# Altium project recall_ble_v0_1.PrjPcb
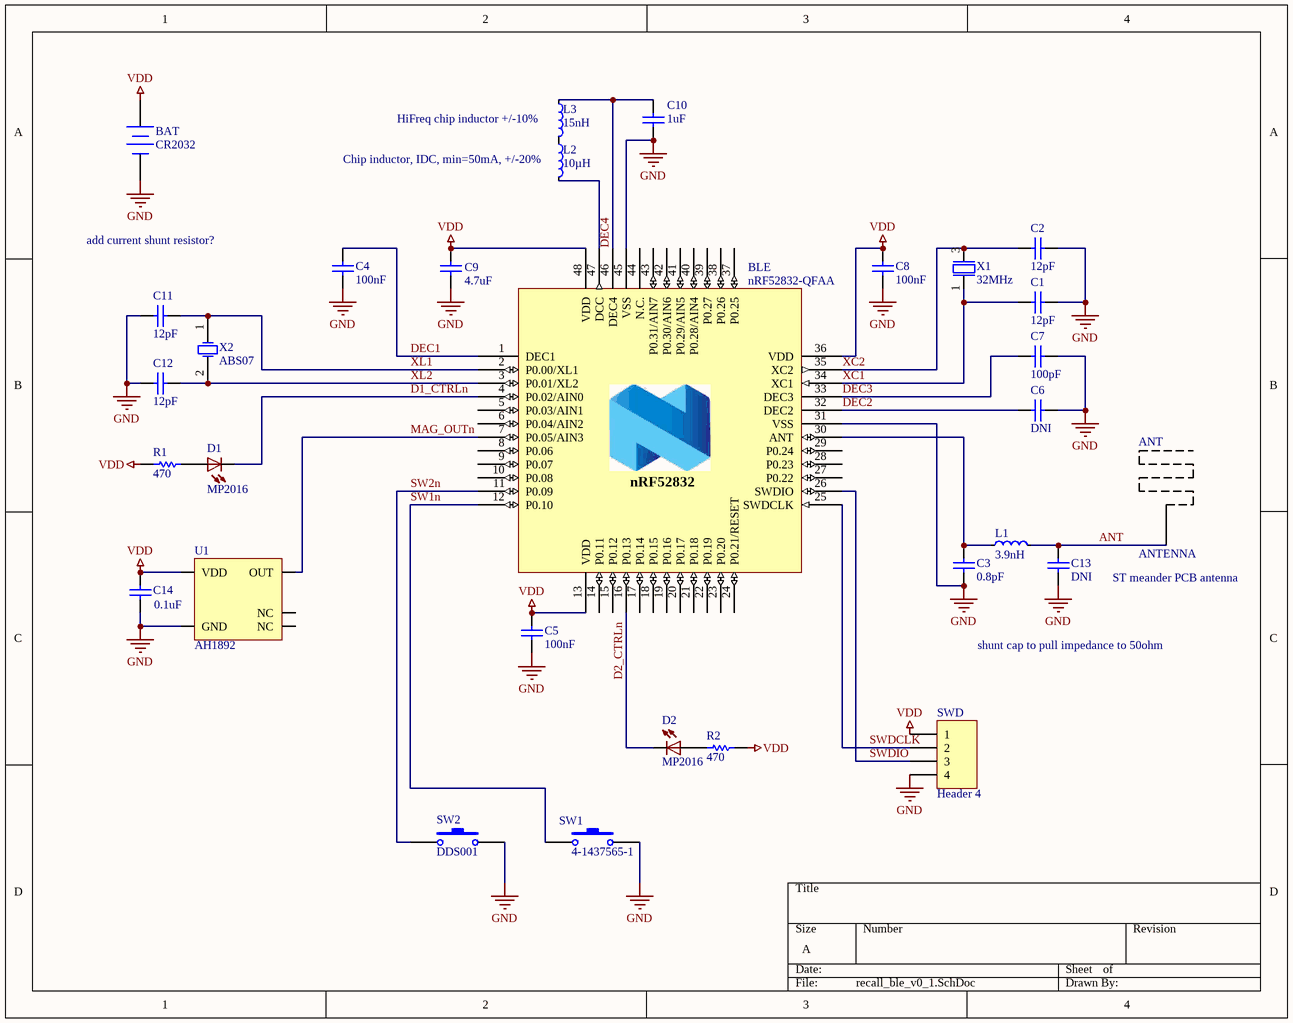
[diagram p0: recall_ble_v0_1.SchDoc]
1 sheet, 30 parts. Net scope: global (net labels, ports and power ports of the same name join across sheets).
Board files: recall_panel_v0_1.PcbDoc, recall_ble_v0_1.PcbDoc

## Sheet recall_ble_v0_1.SchDoc
size A

### Parts
ANT  ANTENNA  [ANTENNA_PCB]
BAT  CR2032  [BAT-HLD-001-THM]
BLE  nRF52832-QFAA  [QFN40P600X600X90-48N]
C1  value 12pF  [CAP_0402R]  (hidden comment: CAP)
C2  value 12pF  [CAP_0402R]  (hidden comment: CAP)
C3  value 0.8pF  [CAP_0402R]  (hidden comment: CAP)
C4  value 100nF  [CAP_0402R]  (hidden comment: CAP)
C5  value 100nF  [CAP_0402R]  (hidden comment: CAP)
C6  value DNI  [CAP_0402R]  (hidden comment: CAP)
C7  value 100pF  [CAP_0402R]  (hidden comment: CAP)
C8  value 100nF  [CAP_0402R]  (hidden comment: CAP)
C9  value 4.7uF  [CAP_0603R]  (hidden comment: CAP)
C10  value 1uF  [CAP_0603R]  (hidden comment: CAP)
C11  value 12pF  [CAP_0402R]  (hidden comment: CAP)
C12  value 12pF  [CAP_0402R]  (hidden comment: CAP)
C13  value DNI  [CAP_0402R]  (hidden comment: CAP)
C14  value 0.1uF  [CAP_0402R]  (hidden comment: CAP)
D1  MP2016  [MP2016_centered]
D2  MP2016  [MP2016_centered]
L1  3.9nH  [INDC1005X04L]
L2  10µH  [INDC1608X06L]
L3  15nH  [INDC1005X04L]
R1  value 470  [RES_0402]  (hidden comment: RES)
R2  value 470  [RES_0402]  (hidden comment: RES)
SW1  4-1437565-1  [4-1437565-1]
SW2  DDS001  [DDS001]
SWD  Header 4  [HDR1X4_SWD]
U1  AH1892  [sot-553]
X1  32MHz  [XRCGB]
X2  ABS07  [ABS07]

### Nets
GND: BAT.2(-) BLE.31(VSS) BLE.45(VSS) BLE.49(GND) C1.2 C2.2 C3.1 C4.1 C5.1 C6.2 C7.2 C8.1 C9.1 C10.1 C11.1 C12.1 C13.1 C14.1 SW1.2 SW2.2 SWD.4 U1.4(GND) X1.2(GND) X1.4(GND)
VDD: BAT.1(+) BLE.13(VDD) BLE.36(VDD) BLE.48(VDD) C5.2 C8.2 C9.2 C14.2 R1.1 R2.1 SWD.1 U1.1(VDD)
ANT: ANT.1 C13.2 L1.2
D1_CTRLn: BLE.4(P0.02/AIN0) D1.C
D2_CTRLn: BLE.16(P0.13) D2.C
DEC1: BLE.1(DEC1) C4.2
DEC2: BLE.32(DEC2) C6.1
DEC3: BLE.33(DEC3) C7.1
DEC4: BLE.46(DEC4) C10.2 L3.1
MAG_OUTn: BLE.7(P0.05/AIN3) U1.5(OUT)
SW1n: BLE.12(P0.10) SW1.1
SW2n: BLE.11(P0.09) SW2.1
SWDCLK: BLE.25(SWDCLK) SWD.2
SWDIO: BLE.26(SWDIO) SWD.3
XC1: BLE.34(XC1) C1.1 X1.1(inp)
XC2: BLE.35(XC2) C2.1 X1.3(out)
XL1: BLE.2(P0.00/XL1) C11.2 X2.1(OSC1)
XL2: BLE.3(P0.01/XL2) C12.2 X2.2(OSC2)
NetBLE_30: BLE.30(ANT) C3.2 L1.1
NetBLE_47: BLE.47(DCC) L2.2
NetD1_A: D1.A R1.2
NetD2_A: D2.A R2.2
NetL2_1: L2.1 L3.2

Not connected (* = marked no-connect by the designer): BLE 5(P0.03/AIN1) 6(P0.04/AIN2) 8(P0.06) 9(P0.07) 10(P0.08) 14(P0.11) 15(P0.12) 17(P0.14) 18(P0.15) 19(P0.16) 20(P0.17) 21(P0.18) 22(P0.19) 23(P0.20) 24(P0.21/RESET) 27(P0.22) 28(P0.23) 29(P0.24) 37(P0.25) 38(P0.26) 39(P0.27) 40(P0.28/AIN4) 41(P0.29/AIN5) 42(P0.30/AIN6) 43(P0.31/AIN7) 44(N.C.); U1 2(NC) 3(NC)

### Notes on the sheet
- (near L2) Chip inductor, IDC, min=50mA, +/-20%
- (near L3) HiFreq chip inductor +/-10%
- add current shunt resistor?
- ST meander PCB antenna
- shunt cap to pull impedance to 50ohm
- (in symbol nRF52832_QFAA) nRF52832

### Library data of the parts
ANT = ANTENNA: PCB Antenna for BLE
BAT = Battery: Published: 24-Mar-1999; LatestRevisionDate: 17-Jul-2002; LatestRevisionNote: Re-released for DXP Platform.; PackageReference: BAT-2; Publisher: Altium Limited; PackageDescription: Battery; 2 Leads
BLE = nRF52832_QFAA: Multi-protocol Bluetooth Low Energy and 2.4GHz proprietary system-on-chip; Manufacturer: Nordic Semiconductor; Artikkelnr Noca: N.A.; Part Number: nRF52832-QFAA; Manufacturer Part Number: nRF52832-QFAA; Datasheet: *; LatestRevisionDate: 2014-11-26; Pin Count: 48; Publisher: Nordic Semiconductor; Published: 2014-11-26; Value: nRF52832-QFAA; Note: *; Supplier: Nordic Semiconductor; Supplier part number: *; 2nd source Supplier: *; 2nd source part number: *; Footprint Doc: QFN-48; Artikkelnr Simpro: N.A.
C1-C14 = CAP: Capacitor; Published: 8-Jun-2000; LatestRevisionDate: 29-May-2009; LatestRevisionNote: IPC-7351 Footprint Added.; PackageReference: C1206; Publisher: Altium Limited; PackageDescription: Chip Capacitor
D1 D2 = MP2016: MP2016 White LED
L1 L3 = IND_0402: High frequency chip inductor ±10%; Part Number: L0402-15n; Manufacturer: Taiyo Yuden; Manufacturer Part Number: HK100515NJ-T; 2nd source part number: 658-1328; Artikkelnr Noca: 33029323; Artikkelnr Simpro: N.A.; LatestRevisionDate: 2012-09-19; Pin Count: 2; Publisher: Nordic Semiconductor; Published: 2010-07-12; Note: High frequency chip inductor ±10%; Supplier: Digi-Key; Datasheet: http://www.yuden.co.jp/productdata/catalog/en/mlci04_e.pdf; Supplier part number: 587-1521-1-ND; 2nd source Supplier: Farnell; Footprint Doc: 0402
  L1: Value: 3.9nH
  L3: Value: 15nH
L2 = IND_0603: Chip inductor, IDC,min = 50 mA, ±20%; Part Number: L0603-10µ; Manufacturer: Taiyo Yuden; Manufacturer Part Number: LBMF1608T100K; 2nd source part number: 178-6105; Note: LBMF1608T100K 10µH 80mA 0603; Artikkelnr Noca: 33029314; Artikkelnr Simpro: N.A.; Datasheet: http://www.yuden.co.jp/ut/product/pdf/elb2_e.pdf; LatestRevisionDate: 2012-09-19; Pin Count: 2; Publisher: Nordic Semiconductor; Published: 2010-02-24; Value: 10µH; Supplier: Digi-Key; Supplier part number: 587-1714-1-ND; 2nd source Supplier: Farnell; Footprint Doc: 0603
R1 R2 = RES: Resistor; Published: 8-Jun-2000; LatestRevisionDate: 17-Jul-2002; LatestRevisionNote: Re-released for DXP Platform.; PackageReference: AXIAL-0.3; Publisher: Altium Limited; PackageDescription: Axial Device, Thru-Hole; 2 Leads; 0.3 in Pin Spacing
SW1 = SW-TACT: Translucent Conductive Silicone Elastomer Switch; Published: 24-Mar-1999; LatestRevisionDate: 17-Jul-2002; LatestRevisionNote: Re-released for DXP Platform.; PackageReference: SPST-2; Publisher: Altium Limited; PackageDescription: Switch; 2 Leads
SW2 = SW-PB: Translucent Conductive Silicone Elastomer Switch; Published: 24-Mar-1999; LatestRevisionDate: 17-Jul-2002; LatestRevisionNote: Re-released for DXP Platform.; PackageReference: SPST-2; Publisher: Altium Limited; PackageDescription: Switch; 2 Leads
SWD = Header 4: Header, 4-Pin; LatestRevisionDate: 17-Jul-2002; LatestRevisionNote: Re-released for DXP Platform.; Publisher: Altium Limited
U1 = AH1892: Hall effect switch
X1 = XRCGB32M000F2P00R0: XTAL SMD 2016, 32MHz, Cl=6pF, Total Tol: ±40ppm; Part Number: XTAL_SMD2016_32MHz_8pF_Epson; Manufacturer: Epson Toyocom; Manufacturer Part Number: Q22FA12800025; Note: XTAL SMD 32.000MHz; Artikkelnr Noca: N.A.; Datasheet: http://www.epsondevice.com/docs/qd/en/DownloadServlet?id=ID000449; LatestRevisionDate: 2014-11-27; Pin Count: 4; Publisher: Nordic Semiconductor; Published: 2012-03-09; Value: 32MHz; Supplier: Farnell; Supplier part number: 171-2806; 2nd source Supplier: *; 2nd source part number: *; Footprint Doc: XTAL_2016; Artikkelnr Simpro: N.A.
X2 = ABS07: ABS25